# Altium schematic sheet Interfaces and Connectors.SCHDOC
size A4
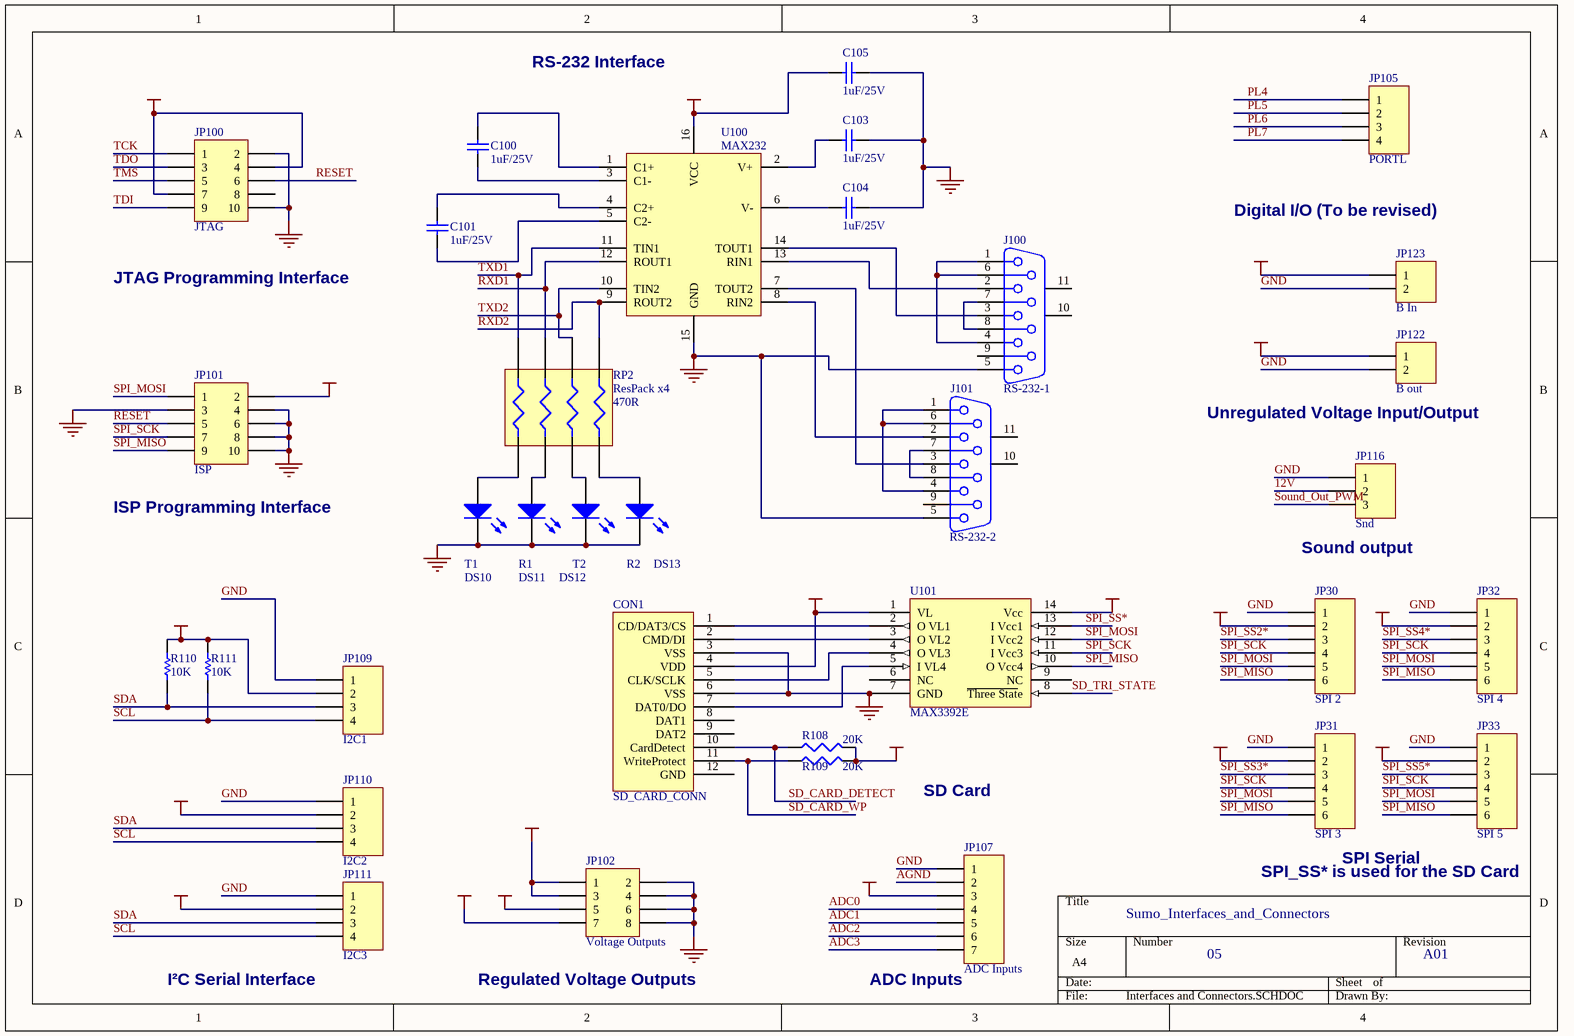
[diagram p0: Interfaces and Connectors.SCHDOC]

## Parts
C100  value 1uF/25V  [CC2012-0805]  (hidden comment: Cap Semi)
C101  value 1uF/25V  [CC2012-0805]  (hidden comment: Cap Semi)
C103  value 1uF/25V  [CC2012-0805]  (hidden comment: Cap Semi)
C104  value 1uF/25V  [CC2012-0805]  (hidden comment: Cap Semi)
C105  value 1uF/25V  [CC2012-0805]  (hidden comment: Cap Semi)
CON1  SD_CARD_CONN  [SD Card AVX]
DS10  T1  [SMD _LED]
DS11  R1  [SMD _LED]
DS12  T2  [SMD _LED]
DS13  R2  [SMD _LED]
J100  RS-232-1  [DSUB1.385-2H9 Simple]
J101  RS-232-2  [DSUB1.385-2H9 Simple]
JP30  SPI 2  [ZHR 1x6 1.5mm]
JP31  SPI 3  [ZHR 1x6 1.5mm]
JP32  SPI 4  [ZHR 1x6 1.5mm]
JP33  SPI 5  [ZHR 1x6 1.5mm]
JP100  JTAG  [HDR2X5]
JP101  ISP  [HDR2X5]
JP102  Voltage Outputs  [microfit 2x4 3mm]
JP105  PORTL  [EHR 1x4 2.5mm]
JP107  ADC Inputs  [KK 1x7 2.54mm]
JP109  I2C1  [ZHR 1x4 1.5mm]
JP110  I2C2  [ZHR 1x4 1.5mm]
JP111  I2C3  [ZHR 1x4 1.5mm]
JP116  Snd  [KK 1x3 2.54mm]
JP122  B out  [Mini-Fit Jnr 2x1 4.2mm]
JP123  B In  [Mini-Fit Jnr 2x1 4.2mm]
R108  value 20K  [CR2012-0805]  (hidden comment: Res3)
R109  value 20K  [CR2012-0805]  (hidden comment: Res3)
R110  10K  [CR2012-0805]
R111  10K  [CR2012-0805]
RP2  ResPack x4  value 470R  [4x0603 Resistor pack]
U100  MAX232  [SO-G16/C5.85]
U101  MAX3392E  [TSSOP14]

## Nets
3V3: CON1.4(VDD) JP102.7 U101.1(VL)
5V: C105.1 JP30.2 JP31.2 JP32.2 JP33.2 JP100.4 JP100.7 JP101.2 JP102.5 JP107.3 JP109.2 JP110.2 JP111.2 R108.2 R109.2 R110.2 R111.2 U100.16(VCC) U101.14(Vcc)
12V: JP102.1 JP102.3 JP116.2
GND: C103.2 C104.2 C105.2 CON1.3(VSS) CON1.6(VSS) DS10.2(K) DS11.2(K) DS12.2(K) DS13.2(K) J100.5 J101.5 JP30.1 JP31.1 JP32.1 JP33.1 JP100.2 JP100.10 JP101.3 JP101.4 JP101.6 JP101.8 JP101.10 JP102.2 JP102.4 JP102.6 JP102.8 JP107.1 JP109.1 JP110.1 JP111.1 JP116.1 JP122.2 JP123.2 U100.15(GND) U101.7(GND)
VBat: JP122.1
VBatIn: JP123.1
ADC0: JP107.4
ADC1: JP107.5
ADC2: JP107.6
ADC3: JP107.7
AGND: JP107.2
PL4: JP105.1
PL5: JP105.2
PL6: JP105.3
PL7: JP105.4
RESET: JP100.6 JP101.5
RXD1: RP2.7 U100.12(ROUT1)
RXD2: RP2.5 U100.9(ROUT2)
SCL: JP109.4 JP110.4 JP111.4 R111.1
SD_CARD_DETECT: CON1.10(CardDetect) R108.1
SD_CARD_WP: CON1.11(WriteProtect) R109.1
SD_TRI_STATE: U101.8(~{Three_Stat}e)
SDA: JP109.3 JP110.3 JP111.3 R110.1
Sound_Out_PWM: JP116.3
SPI_MISO: JP30.6 JP31.6 JP32.6 JP33.6 JP101.9 U101.10(O_Vcc4)
SPI_MOSI: JP30.5 JP31.5 JP32.5 JP33.5 JP101.1 U101.12(I_Vcc2)
SPI_SCK: JP30.4 JP31.4 JP32.4 JP33.4 JP101.7 U101.11(I_Vcc3)
SPI_SS2*: JP30.3
SPI_SS3*: JP31.3
SPI_SS4*: JP32.3
SPI_SS5*: JP33.3
SPI_SS*: U101.13(I_Vcc1)
TCK: JP100.1
TDI: JP100.9
TDO: JP100.3
TMS: JP100.5
TXD1: RP2.8 U100.11(TIN1)
TXD2: RP2.6 U100.10(TIN2)
NetC100_1: C100.1 U100.3(C1-)
NetC100_2: C100.2 U100.1(C1+)
NetC101_1: C101.1 U100.5(C2-)
NetC101_2: C101.2 U100.4(C2+)
NetC103_1: C103.1 U100.2(V+)
NetC104_1: C104.1 U100.6(V-)
NetCON1_1: CON1.1(CD/DAT3/CS) U101.2(O_VL1)
NetCON1_2: CON1.2(CMD/DI) U101.3(O_VL2)
NetCON1_5: CON1.5(CLK/SCLK) U101.4(O_VL3)
NetCON1_7: CON1.7(DAT0/DO) U101.5(I_VL4)
NetDS10_1: DS10.1(A) RP2.1
NetDS11_1: DS11.1(A) RP2.2
NetDS12_1: DS12.1(A) RP2.3
NetDS13_1: DS13.1(A) RP2.4
NetJ100_1: J100.1 J100.4 J100.6
NetJ100_2: J100.2 U100.13(RIN1)
NetJ100_3: J100.3 U100.14(TOUT1)
NetJ100_7: J100.7 J100.8
NetJ101_1: J101.1 J101.4 J101.6
NetJ101_2: J101.2 U100.8(RIN2)
NetJ101_3: J101.3 U100.7(TOUT2)
NetJ101_7: J101.7 J101.8

Not connected (* = marked no-connect by the designer): CON1 8(DAT1) 9(DAT2) 12(GND); J100 9 10(MH1) 11(MH2); J101 9 10(MH1) 11(MH2); JP100 8; U101 6(NC) 9(NC)

## Notes on the sheet
- RS-232 Interface
- Digital I/O (To be revised)
- JTAG Programming Interface
- Unregulated Voltage Input/Output
- (near JP101) ISP Programming Interface
- Sound output
- SD Card
- Sumo_Interfaces_and_Connectors
- SPI_SS* is used for the SD Card
- SPI Serial
- (near JP111) I²C Serial Interface
- (near JP102) Regulated Voltage Outputs
- (near JP107) ADC Inputs
- 05
- A01

## Library data of the parts
C100 C101 C103-C105 = Cap Semi: Capacitor (Semiconductor SIM Model); Published: 8-Jun-2000; Revision: July-2002: Re-released for DXP Platform.; Publisher: Altium Limited
DS10-DS13 = LED3: Typical BLUE SiC LED; Revision 1: Jul-2002: Re-released for DXP Platform.; Revision 2: 17-Dec-2003: PCB Footprint replaced.; Published: 8-Jun-2000; Publisher: Altium Limited
J100 J101 = D Connector 9: Receptacle Assembly, 9 Position, Right Angle; Package Information: Latest Revision: O; Positions: 9; Published: 15-Jun-2001; Revision: 17-Jul-2002: Re-released for DXP Platform.; Datasheet: (1-Sep-1999); Package Reference: 788750; Publisher: Altium Limited; Orientation: Right Angle; Gender: Receptacle
JP30-JP33 = Header 6: Header, 6-Pin; Revision: 17-Jul-2002: Re-released for DXP Platform.; Publisher: Altium Limited
JP100 JP101 = Header 5X2: Header, 5-Pin, Dual row; Revision: 17-Jul-2002: Re-released for DXP Platform.; Publisher: Altium Limited
JP102 = Header 4X2: Header, 4-Pin, Dual row; Revision: 17-Jul-2002: Re-released for DXP Platform.; Publisher: Altium Limited
JP105 JP109-JP111 = Header 4: Header, 4-Pin; Revision: 17-Jul-2002: Re-released for DXP Platform.; Publisher: Altium Limited
JP107 = Header 7: Header, 7-Pin; Revision: 17-Jul-2002: Re-released for DXP Platform.; Publisher: Altium Limited
JP116 = Header 3: Header, 3-Pin; Revision: 17-Jul-2002: Re-released for DXP Platform.; Publisher: Altium Limited
JP122 JP123 = Header 2: Header, 2-Pin; Revision: 17-Jul-2002: Re-released for DXP Platform.; Publisher: Altium Limited
R108 R109 = Res3: Resistor; Published: 8-Jun-2000; Revision: July-2002: Re-released for DXP Platform.; Publisher: Altium Limited
R110 R111 = Res1: Resistor; Published: 8-Jun-2000; Revision: July-2002: Re-released for DXP Platform.; Publisher: Altium Limited
U100 = MAX232: Maxim RS-232 Transceiver